# EasyEDA schematic SCH_PIANO PIC16F88_2024-05-19.json
TITLE: PIC PIANO (PIC16F88); REV: 1.0; Date: 2024-05-19; Sheet: 1/1; Drawn By: Didyk Volodymyr; Company: PCB
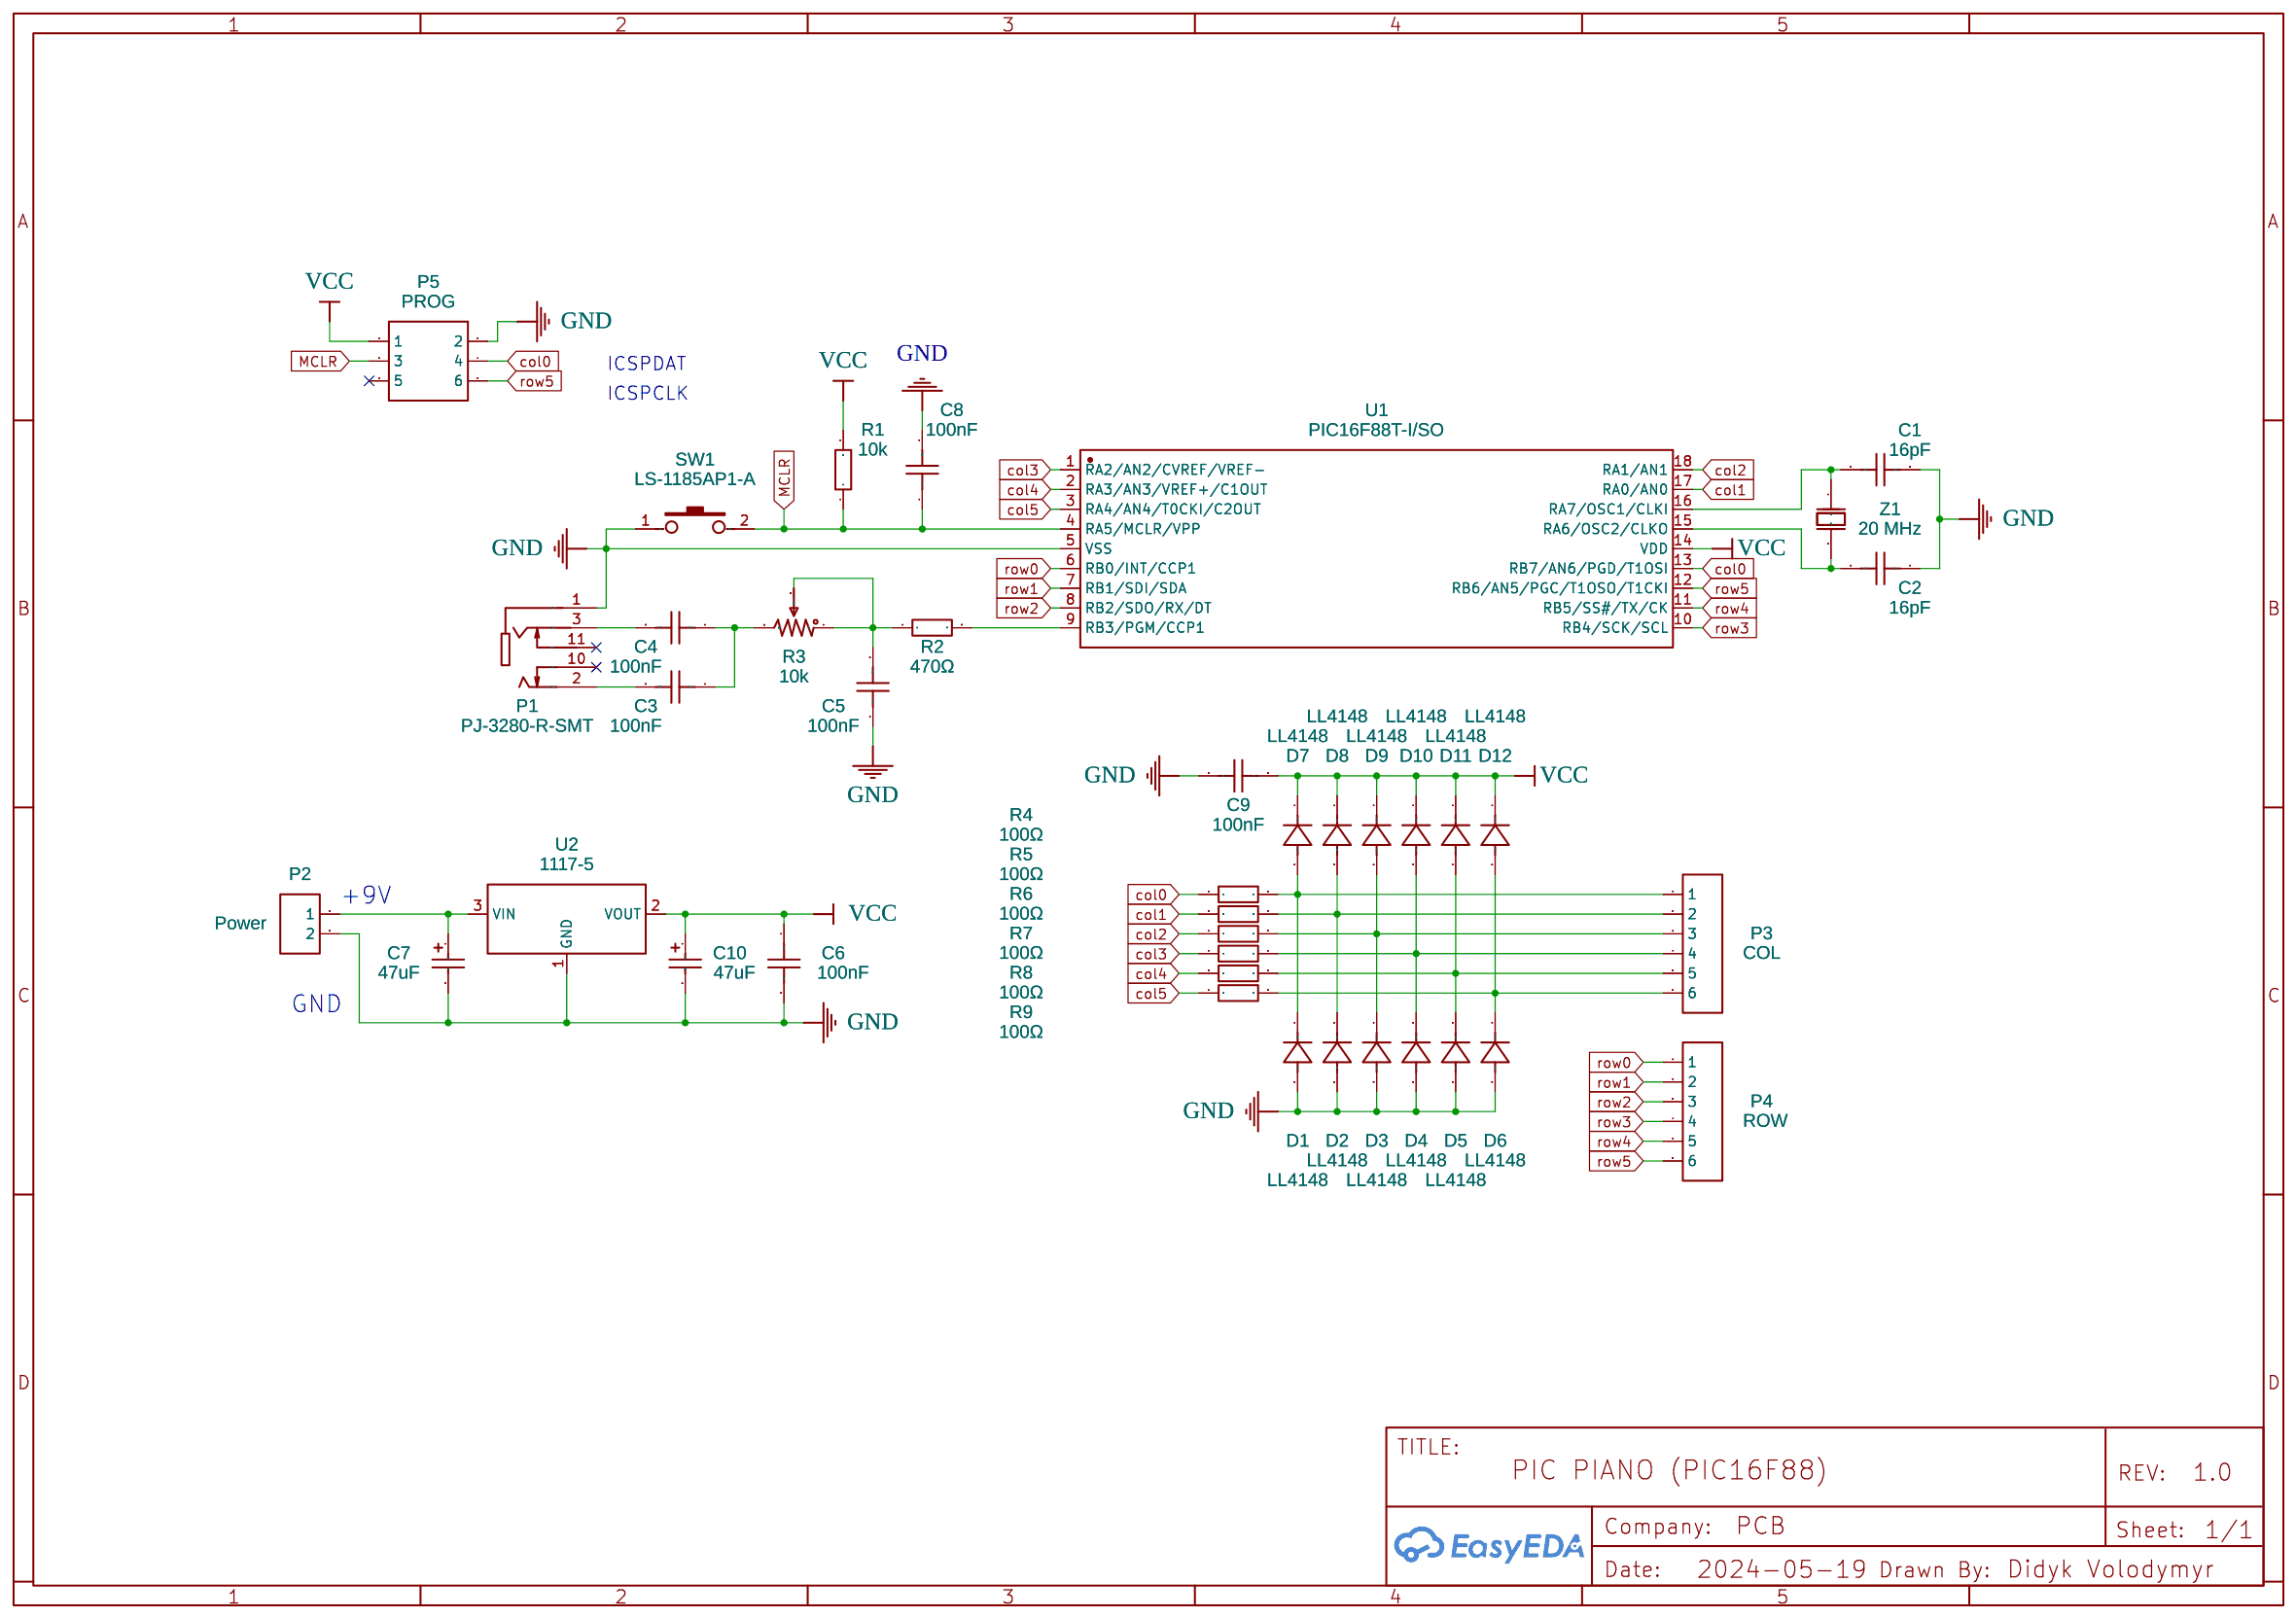
[diagram p0: schematic sheet]

## Parts
C1  16pF  [C0805]
C2  16pF  [C0805]
C3  100nF  [C0805]
C4  100nF  [C0805]
C5  100nF  [C0805]
C6  100nF  [C0805]
C7  47uF  [CAP-SMD_L3.2-W1.6-RD-C7171]
C8  100nF  [C0805]
C9  100nF  [C0805]
C10  47uF  [CAP-SMD_L3.2-W1.6-RD-C7171]
D1  LL4148  [LL-34_L3.5-W1.5-RD]
D2  LL4148  [LL-34_L3.5-W1.5-RD]
D3  LL4148  [LL-34_L3.5-W1.5-RD]
D4  LL4148  [LL-34_L3.5-W1.5-RD]
D5  LL4148  [LL-34_L3.5-W1.5-RD]
D6  LL4148  [LL-34_L3.5-W1.5-RD]
D7  LL4148  [LL-34_L3.5-W1.5-RD]
D8  LL4148  [LL-34_L3.5-W1.5-RD]
D9  LL4148  [LL-34_L3.5-W1.5-RD]
D10  LL4148  [LL-34_L3.5-W1.5-RD]
D11  LL4148  [LL-34_L3.5-W1.5-RD]
D12  LL4148  [LL-34_L3.5-W1.5-RD]
P1  PJ-3280-R-SMT  [AUDIO-SMD_PJ-3280-R-SMT]
P2  Power  [HDR-M-2.54_1X2]
P3  COL  [HDR-M-2.54_1X6]
P4  ROW  [HDR-M-2.54_1X6]
P5  PROG  [HDR-F-2.54_2X3]
R1  10k  [R0805]
R2  470Ω  [R0805]
R3  10k  [RES-ADJ-TH_3362P]
R4  100Ω  [R0805]
R5  100Ω  [R0805]
R6  100Ω  [R0805]
R7  100Ω  [R0805]
R8  100Ω  [R0805]
R9  100Ω  [R0805]
SW1  LS-1185AP1-A  [SW-SMD_L4.0-W3.0-LS5.0]
U1  PIC16F88T-I/SO  [SOIC-18_L11.6-W7.5-P1.27-LS10.3-BL]
U2  1117-5  [SOT-223-3_L6.5-W3.4-P2.30-LS7.0-BR-1]
Z1  20 MHz  [HC-49S_L10.8-W4.4-P4.88]

## Library data of the parts
C1-C6 C8 C9 = 0805N220J500CT-C: Contributor: lcsc; Supplier: LCSC; Supplier Part: C2991347; Manufacturer: Walsin(华新科); link: https://lcsc.com/eda_search?q=C2991347&%26type=1&ref=editor
C7 C10 = TAJA106K016RNJ: Supplier: LCSC; Manufacturer: Kyocera AVX; Supplier Part: C7171; JLCPCB Part Class: Basic Part
D1-D12 = LL4148-MS: Contributor: LCSC; Supplier: LCSC; Supplier Part: C2847029; Manufacturer: MSKSEMI(美森科); JLCPCB Part Class: Extended Part; link: https://lcsc.com/eda_search?q=C2847029&%26type=1&ref=editor
P1 = PJ-3280-R-SMT: Contributor: LCSC; Supplier: LCSC; Supplier Part: C2885045; Manufacturer: XKB Connectivity(中国星坤); JLCPCB Part Class: Extended Part; link: https://lcsc.com/eda_search?q=C2885045&%26type=1&ref=editor
P2 = HDR-M-2.54_1x2: Supplier Part: C124375; Supplier: LCSC; Contributor: LCEDA_Lib
P3 P4 = HDR-M-2.54_1x6: Supplier Part: C190819; Supplier: LCSC; Contributor: LCEDA_Lib
P5 = HDR-F-2.54_2x3: Supplier Part: C65114; Supplier: LCSC; Contributor: LCEDA_Lib
R1 R2 R4-R9 = AF0805JR-07100RL: Contributor: LCSC; Supplier: LCSC; Manufacturer: YAGEO(国巨); Supplier Part: C144126; JLCPCB Part Class: Extended Part; link: https://lcsc.com/eda_search?q=C144126&%26type=1&ref=editor
R3 = 3362P-1-504: Resistance(Ohms): 500K; Contributor: LCSC; Supplier: LCSC; Supplier Part: C125021; Manufacturer: BOCHEN(博晨); JLCPCB Part Class: Extended Part; link: https://lcsc.com/eda_search?q=C125021&%26type=1&ref=editor
SW1 = LS-1185AP1-A: Supplier: LCSC; Supplier Part: C2766085; Manufacturer: null; Contributor: LCSC; JLCPCB Part Class: Extended Part
U1 = PIC16F88T-I/SO: Contributor: lcsc; Supplier: LCSC; Supplier Part: C631564; Manufacturer: MICROCHIP(美国微芯); JLCPCB Part Class: Extended Part; link: https://lcsc.com/eda_search?q=C631564&%26type=1&ref=editor
U2 = 1117-5: Contributor: lcsc; Supplier: LCSC; Supplier Part: C5125089; Manufacturer: IDCHIP(英锐芯); JLCPCB Part Class: Extended Part; link: https://lcsc.com/eda_search?q=C5125089&%26type=1&ref=editor
Z1 = SIP-2HC-49S: Contributor: LCSC; Supplier: LCSC; Supplier Part: C9900006185; Manufacturer: null; JLCPCB Part Class: Extended Part; link: https://lcsc.com/eda_search?q=C9900006185&%26type=1&ref=editor

## Nets
GND: C1.2 C2.1 C5.1 C6.2 C7.2 C8.2 C9.1 C10.2 D1.2(A) D2.2(A) D3.2(A) D4.2(A) D5.2(A) D6.2(A) P1.1 P2.2 P5.2 SW1.1 U1.5(VSS) U2.1(GND)
VCC: C6.1 C9.2 C10.1 D7.1(K) D8.1(K) D9.1(K) D10.1(K) D11.1(K) D12.1(K) P5.1 R1.2 U1.14(VDD) U2.2(VOUT)
col0: P5.4 R4.1 U1.13(RB7/AN6/PGD/T1OSI)
col1: R5.1 U1.17(RA0/AN0)
col2: R6.1 U1.18(RA1/AN1)
col3: R7.1 U1.1(RA2/AN2/CVREF/VREF-)
col4: R8.1 U1.2(RA3/AN3/VREF+/C1OUT)
col5: R9.1 U1.3(RA4/AN4/T0CKI/C2OUT)
MCLR: C8.1 P5.3 R1.1 SW1.2 U1.4(RA5/MCLR/VPP)
row0: P4.1 U1.6(RB0/INT/CCP1)
row1: P4.2 U1.7(RB1/SDI/SDA)
row2: P4.3 U1.8(RB2/SDO/RX/DT)
row3: P4.4 U1.10(RB4/SCK/SCL)
row4: P4.5 U1.11(RB5/SS#/TX/CK)
row5: P4.6 P5.6 U1.12(RB6/AN5/PGC/T1OSO/T1CKI)
Net-(C1-1): C1.1 U1.16(RA7/OSC1/CLKI) Z1.1(OSC1)
Net-(C2-2): C2.2 U1.15(RA6/OSC2/CLKO) Z1.2(OSC2)
Net-(C3-1): C3.1 C4.1 R3.3
Net-(C3-2): C3.2 P1.2(5)
Net-(C4-2): C4.2 P1.3
Net-(C5-2): C5.2 R2.1 R3.1 R3.2
Net-(C7-1): C7.1 P2.1 U2.3(VIN)
Net-(D1-1): D1.1(K) D7.2(A) P3.1 R4.2
Net-(D2-1): D2.1(K) D8.2(A) P3.2 R5.2
Net-(D3-1): D3.1(K) D9.2(A) P3.3 R6.2
Net-(D4-1): D4.1(K) D10.2(A) P3.4 R7.2
Net-(D5-1): D5.1(K) D11.2(A) P3.5 R8.2
Net-(D6-1): D6.1(K) D12.2(A) P3.6 R9.2
Net-(R2-2): R2.2 U1.9(RB3/PGM/CCP1)

Not connected (* = marked no-connect by the designer): P1 10* 11*; P5 5*

## Notes on the sheet
- ICSPDAT
- ICSPCLK
- +9V
- GND
